# EAGLE design 28DIP (EAGLE 6.4)
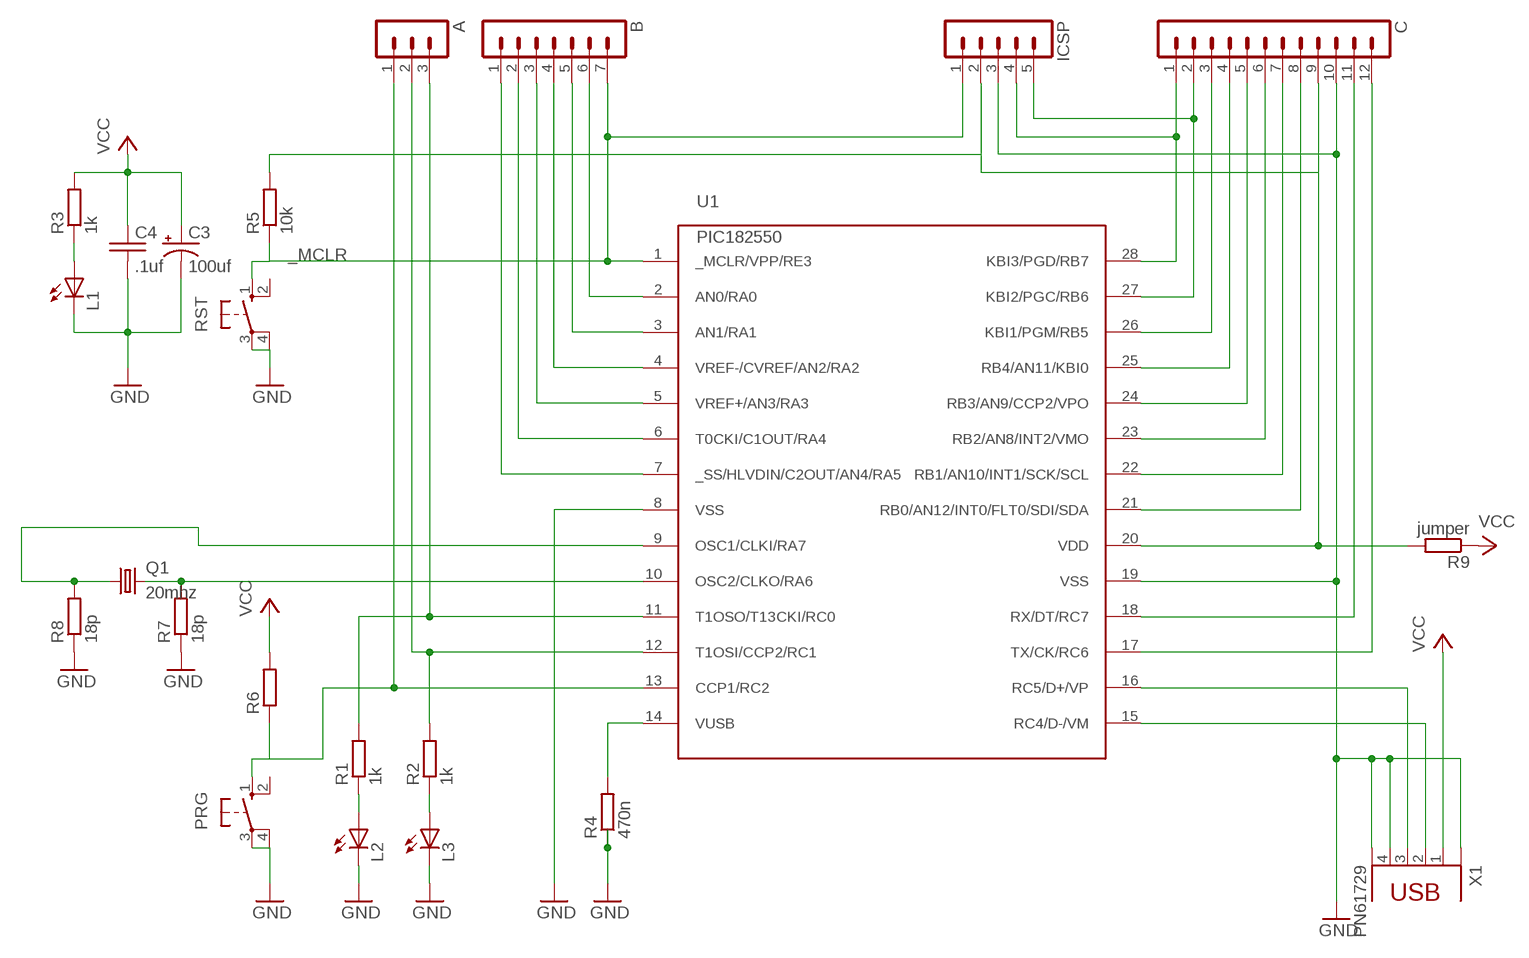
[diagram p0: schematic, sheet 1]

## Parts
A  MA03-1  [MA03-1]
B  MA07-1  [MA07-1]
C  MA12-1  [MA12-1]
C3  100uf  CAP_ELECTROLYTICCAP_0200ELECTROLYTIC_0250  [CAP_0200ELECTROLYTIC_0250]
C4  .1uf  CAPCAP_0100  [CAP_0100]
ICSP  MA05-1  [MA05-1]
L1  LED  [LED5MM]
L2  LED  [LED5MM]
L3  LED  [LED5MM]
PRG  10-XX  [B3F-10XX]
Q1  20mhz  CRYTALHC49S  [HC49/S]
R1  1k  R-EU_M0805  [M0805]
R2  1k  R-EU_M0805  [M0805]
R3  1k  R-EU_M0805  [M0805]
R4  470n  R-EU_M0805  [M0805]
R5  10k  R-EU_M0805  [M0805]
R6  R-EU_M0805  [M0805]
R7  18p  R-EU_M0805  [M0805]
R8  18p  R-EU_M0805  [M0805]
R9  jumper  R-EU_M1206  [M1206]
RST  10-XX  [B3F-10XX]
U1  PIC182550  PIC182455  [DIL28-3]
X1  PN61729  [PN61729]

## Nets
_MCLR: B.7 ICSP.1 R5.1 RST.1(S) U1.1(_MCLR/VPP/RE3)
GND: C3.- C4.2 C.10 ICSP.3 L1.K(C) L2.K(C) L3.K(C) PRG.3(P) PRG.4(P1) R4.1 R7.1 R8.1 RST.3(P) RST.4(P1) U1.8(VSS) U1.19(VSS) X1.4 X1.GND1(G1) X1.GND2(G2)
N$1: U1.16(RC5/D+/VP) X1.3
N$2: C.9 ICSP.2 R5.2 R9.2 U1.20(VDD)
N$4: U1.15(RC4/D-/VM) X1.2
N$5: R4.2 U1.14(VUSB)
N$6: L2.A R1.1
N$7: A.1 PRG.1(S) R6.1 U1.13(CCP1/RC2)
N$8: L3.A R2.1
N$9: L1.A R3.1
N$10: A.3 R1.2 U1.11(T1OSO/T13CKI/RC0)
N$11: A.2 R2.2 U1.12(T1OSI/CCP2/RC1)
N$12: C.1 ICSP.4 U1.28(KBI3/PGD/RB7)
N$13: C.2 ICSP.5 U1.27(KBI2/PGC/RB6)
N$14: C.3 U1.26(KBI1/PGM/RB5)
N$15: C.4 U1.25(RB4/AN11/KBI0)
N$16: C.5 U1.24(RB3/AN9/CCP2/VPO)
N$17: C.6 U1.23(RB2/AN8/INT2/VMO)
N$18: C.7 U1.22(RB1/AN10/INT1/SCK/SCL)
N$19: C.8 U1.21(RB0/AN12/INT0/FLT0/SDI/SDA)
N$20: B.6 U1.2(AN0/RA0)
N$21: B.5 U1.3(AN1/RA1)
N$22: B.4 U1.4(VREF-/CVREF/AN2/RA2)
N$23: B.3 U1.5(VREF+/AN3/RA3)
N$24: B.2 U1.6(T0CKI/C1OUT/RA4)
N$25: B.1 U1.7(_SS/HLVDIN/C2OUT/AN4/RA5)
N$26: C.12 U1.17(TX/CK/RC6)
N$27: C.11 U1.18(RX/DT/RC7)
N$28: Q1.2 R7.2 U1.10(OSC2/CLKO/RA6)
N$31: Q1.1 R8.2 U1.9(OSC1/CLKI/RA7)
VCC: C3.+ C4.1 R3.2 R6.2 R9.1 X1.1
Unconnected: PRG.2(S1) RST.2(S1)

## Library data of the parts
A = UBW:MA03-1: PIN HEADER
B = UBW:MA07-1: PIN HEADER
C = UBW:MA12-1: PIN HEADER
C3 = UBW:CAP_ELECTROLYTIC
C4 = UBW:CAP
ICSP = UBW:MA05-1: PIN HEADER
L1-L3 = UBW:LED
PRG RST = switch-omron:10-XX: OMRON SWITCH; MPN: B3F-1000; OC_FARNELL: 176432; OC_NEWARK: 36M3542
Q1 = crystal:CRYTAL: CRYSTAL
R1-R9 = resistor:R-EU_: RESISTOR, European symbol
U1 = UBW:PIC18*2455
X1 = UBW:PN61729: BERG USB connector

## Board
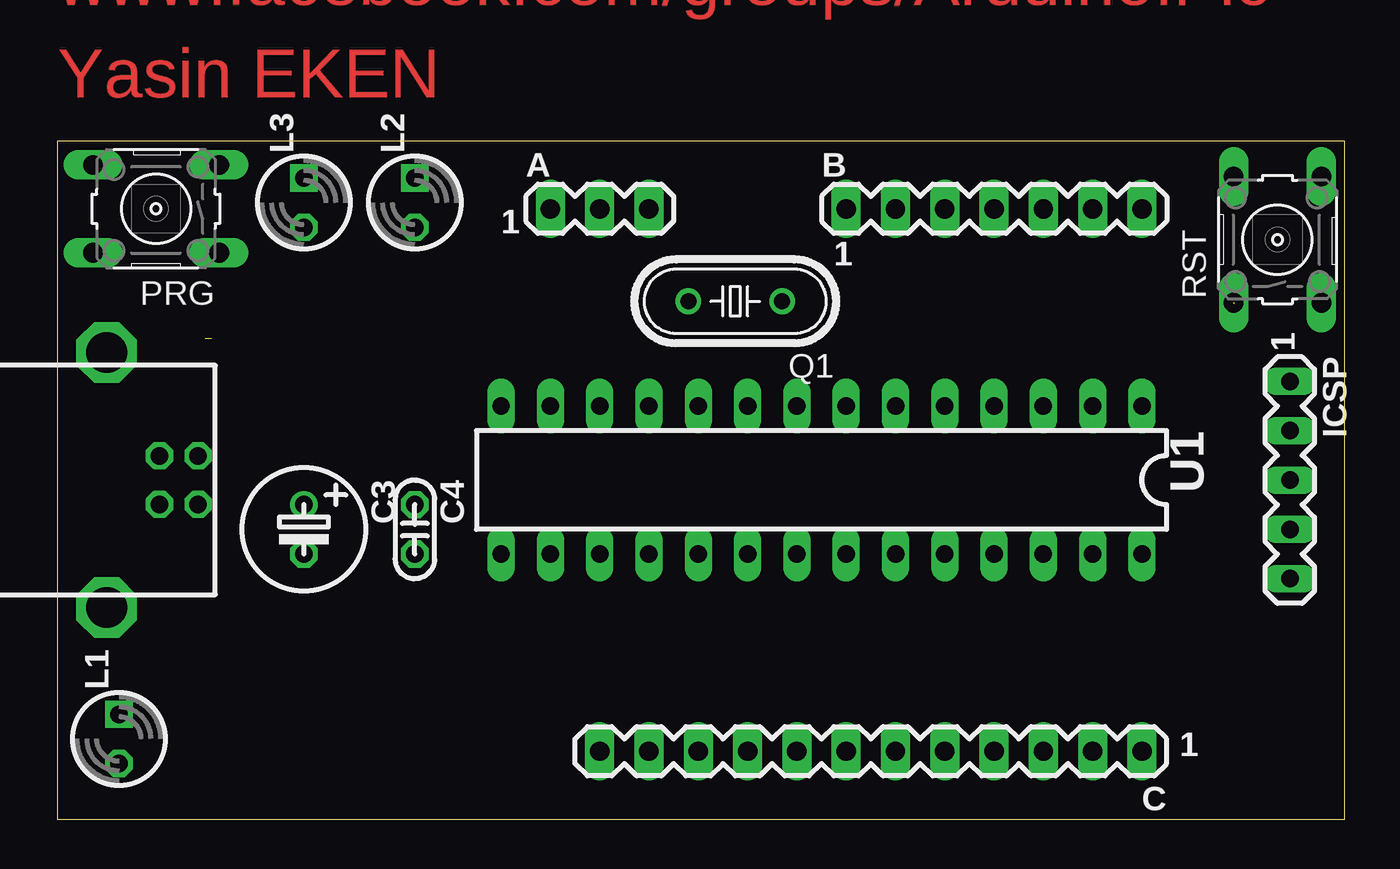
[diagram p1: board, top side]
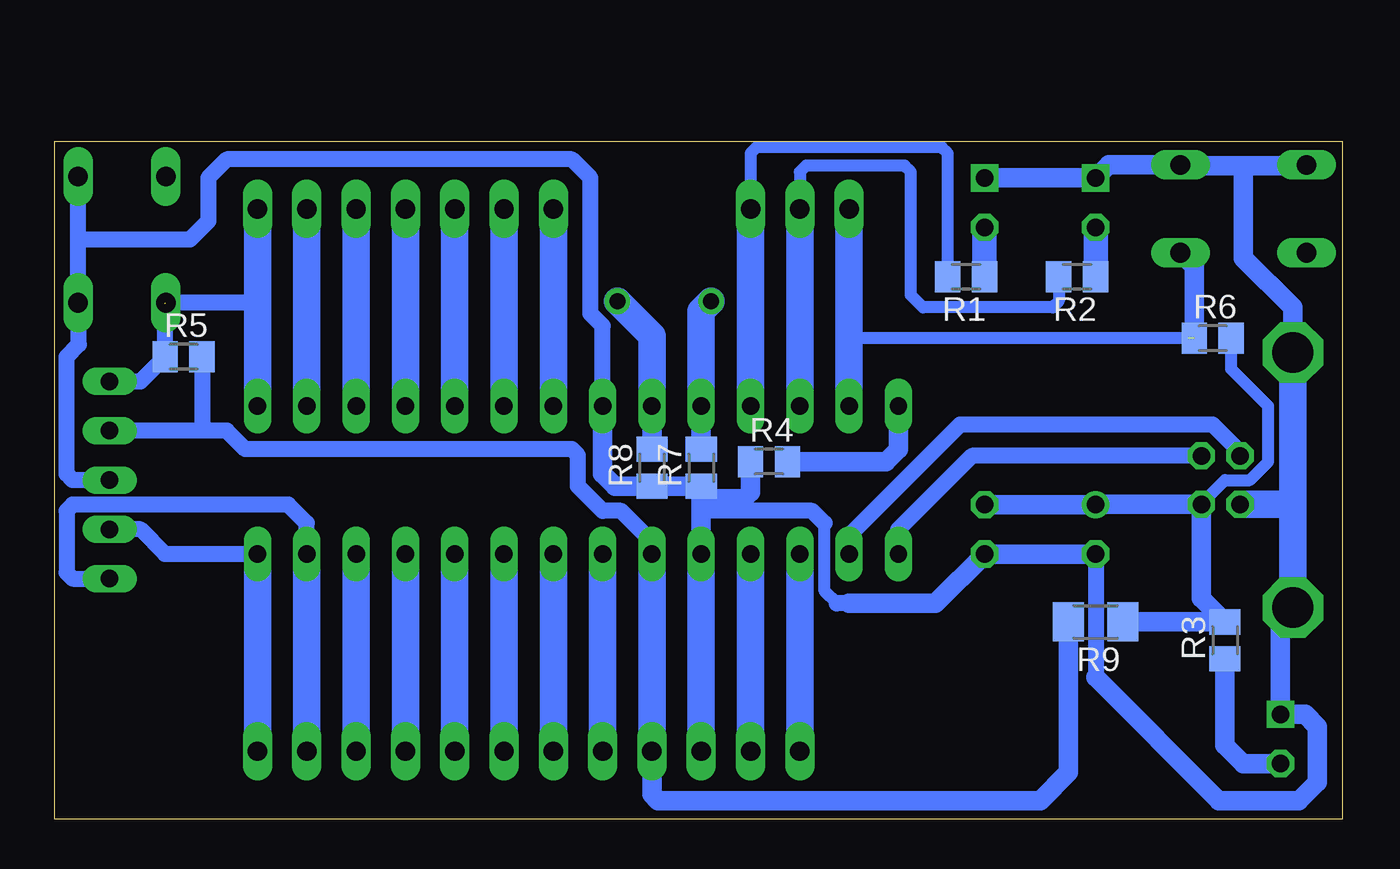
[diagram p2: board, bottom side, seen from below]

Size 66.34 x 34.91 mm. Coordinates in mm from the lower left corner, seen from the top.
Outline: 0,0 66.34,0 66.34,34.91 0,34.91 0,0
Copper layers (1*16): Top 0.035mm / dielectric 1.5mm / Bottom 0.035mm
Design rules "default": minimum track width 10mil, minimum drill 24mil, track to track 8mil, track to pad 8mil, pad to pad 8mil, via to via 8mil, smd to smd 8mil, copper to edge 40mil, drill to drill 8mil, minimum pad ring 10mil, minimum via ring 8mil, stop-mask expansion 4mil, vias tented up to drill 0mil, thermal gap 10mil

### Footprints (pad centres in the part's own frame; a part is rotated, then mirrored left to right if it is on the bottom)
MA03-1 = drill 1 pad 1.27 long: 1 -2.54,0; 2 0,0; 3 2.54,0
MA07-1 = drill 1 pad 1.27 long: 1 -7.62,0; 2 -5.08,0; 3 -2.54,0; 4 0,0; 5 2.54,0; 6 5.08,0; 7 7.62,0
MA12-1 = drill 1 pad 1.27 long: 1 -13.97,0; 2 -11.43,0; 3 -8.89,0; 4 -6.35,0; 5 -3.81,0; 6 -1.27,0; 7 1.27,0; 8 3.81,0; 9 6.35,0; 10 8.89,0; 11 11.43,0; 12 13.97,0
CAP_0200ELECTROLYTIC_0250 = drill 0.9: + -1.27,0 | drill 0.9 octagon: - 1.27,0
CAP_0100 = drill 0.9 octagon: 1 -1.27,0; 2 1.27,0
MA05-1 = drill 0.9 pad 1.27 long: 1 -5.08,0; 2 -2.54,0; 3 0,0; 4 2.54,0; 5 5.08,0
LED5MM = drill 0.9 octagon: A -1.27,0 | drill 0.9 square: K 1.27,0
B3F-10XX = drill 1.016 long: 1 -3.251,2.261; 2 3.251,2.261; 3 -3.251,-2.261; 4 3.251,-2.261
HC49/S = drill 0.813: 1 -2.413,0; 2 2.413,0
M0805 = smd 1.3 x 1.6: 1 -0.95,0; 2 0.95,0
M1206 = smd 1.6 x 2: 1 -1.4,0; 2 1.4,0
DIL28-3 = drill 0.9 long: 1 -16.51,-3.81; 2 -13.97,-3.81; 3 -11.43,-3.81; 4 -8.89,-3.81; 5 -6.35,-3.81; 6 -3.81,-3.81; 7 -1.27,-3.81; 8 1.27,-3.81; 9 3.81,-3.81; 10 6.35,-3.81; 11 8.89,-3.81; 12 11.43,-3.81; 13 13.97,-3.81; 14 16.51,-3.81; 15 16.51,3.81; 16 13.97,3.81; 17 11.43,3.81; 18 8.89,3.81; 19 6.35,3.81; 20 3.81,3.81; 21 1.27,3.81; 22 -1.27,3.81; 23 -3.81,3.81; 24 -6.35,3.81; 25 -8.89,3.81; 26 -11.43,3.81; 27 -13.97,3.81; 28 -16.51,3.81
PN61729 = drill 0.9 octagon: 1 1.25,4.71; 2 -1.25,4.71; 3 -1.25,2.71; 4 1.25,2.71 | drill 2.1 octagon: GND1 -6.57,0; GND2 6.57,0

### Placement (x,y rotation side)
A  27.94,31.43 0 top
B  48.26,31.43 0 top
C  41.91,3.49 180 top
C3  12.7,14.92 270 top
C4  18.41,14.92 270 top
ICSP  63.5,17.46 270 top
L1  3.17,4.13 90 top
L2  18.41,31.75 90 top
L3  12.7,31.75 90 top
PRG  5.08,31.43 180 top
Q1  34.92,26.67 180 top
R1  19.37,27.94 180 bottom
R2  13.65,27.94 180 bottom
R3  6.03,9.21 90 bottom
R4  29.53,18.41 0 bottom
R5  59.69,23.81 0 bottom
R6  6.67,24.77 0 bottom
R7  33.02,18.1 90 bottom
R8  35.56,18.1 90 bottom
R9  12.7,10.16 180 bottom
RST  62.87,29.84 90 top
U1  39.37,17.46 180 top
X1  2.54,17.46 270 top

### Tracks (layer width: path | path; a pad name or v marks a point on that pad's centre or on a via)
_MCLR  (2 unrouted)
  Bottom 0.813: 55.88,32.39 B.7 | R5.1 60.64,26.56 | ICSP.1 61.91,22.54 R5.1 60.64,26.56 | 55.88,26.59 RST.1
  Bottom 1.422: U1.1 55.88,26.59 B.7
GND
  Bottom 0.61: 26.04,11.11 26.67,11.75 26.67,15.24
  Bottom 0.813: C3.- 12.7,7.3 | 25.4,11.11 26.04,11.11 | 26.67,15.24 27.3,15.87 33.02,15.87 | ICSP.3 65.41,17.46 65.72,17.78 65.72,23.81 65.09,24.45 65.09,26.56 RST.3 65.13,29.84 | 65.13,29.84 RST.4 | 38.1,17.78 38.1,25.4 38.73,26.03 38.73,33.02 39.69,33.97 57.47,33.97 58.42,33.02 58.42,30.8 59.37,29.84 65.13,29.84
  Bottom 1.016: R7.1 R8.1 37.47,17.15 38.1,17.78 U1.8 | R7.1 33.02,15.87 U1.19 | X1.GND2 3.17,10.26 L1.K 1.91,5.4 1.27,4.76 1.27,1.91 2.22,0.95 6.35,0.95 12.7,7.3 | R7.1 33.02,16.83 32.7,16.51 30.8,16.51 30.48,16.83 R4.1 | C3.- C4.2 20.95,11.11 25.4,11.11 | X1.GND1 2.54,26.35 5.08,28.89 5.08,33.66 | 5.08,33.66 1.79,33.66 | 1.27,33.66 1.79,33.66 | 1.79,33.66 PRG.4 | L2.K L3.K 12.03,33.69 PRG.3 8.29,33.66 5.08,33.66
  Bottom 1.422: C.10 U1.19 | X1.GND2 2.54,15.87 | 2.54,15.87 X1.GND1 | X1.4 2.88,16.21 2.54,15.87
N$1
  Bottom 0.813: X1.3 5.25,18.9 6.67,20.32 19.68,20.32 25.4,14.6 U1.16
N$2
  Bottom 0.813: U1.20 35.56,14.29 37.15,15.87 38.1,15.87 39.37,17.14 39.37,18.73 39.69,19.05 56.52,19.05 57.47,20 58.42,20 | 58.42,20 ICSP.2 | R5.2 58.74,20.32 58.42,20
  Bottom 1.016: R9.2 14.1,2.41 15.56,0.95 35.24,0.95 35.56,1.27 C.9
  Bottom 1.422: C.9 U1.20
N$4
  Bottom 0.813: X1.2 19.07,18.71 22.86,14.92 U1.15
N$5
  Bottom 1.016: R4.2 23.5,18.41 22.86,19.05 U1.14
N$6
  Bottom 1.27: L2.A R1.1
N$7  (1 unrouted)
  Bottom 0.61: 7.62,25.08 7.94,24.76 25.4,24.76
  Bottom 1.016: 7.62,25.08 7.62,28.46 PRG.1
  Bottom 1.422: U1.13 25.4,24.76 A.1
N$8
  Bottom 1.27: R2.1 L3.A
N$9
  Bottom 1.016: R3.1 6.03,3.81 5.08,2.86 L1.A
N$10
  Bottom 0.61: R1.2 20.32,34.29 20.64,34.61 30.16,34.61 30.48,34.29 A.3
  Bottom 1.422: U1.11 A.3
N$11
  Bottom 0.61: R2.2 14.6,26.67 14.92,26.35 21.59,26.35 22.23,26.99 22.23,33.34 22.54,33.66 27.62,33.66 27.94,33.34 A.2
  Bottom 1.422: U1.12 A.2
N$12
  Bottom 0.813: U1.28 60.64,13.65 61.91,14.92 ICSP.4
  Bottom 1.422: C.1 U1.28
N$13
  Bottom 0.813: U1.27 53.34,15.24 54.29,16.19 65.41,16.19 65.72,15.87 65.72,12.7 65.41,12.38 ICSP.5
  Bottom 1.422: C.2 U1.27
N$14
  Bottom 1.422: C.3 U1.26
N$15
  Bottom 1.422: C.4 U1.25
N$16
  Bottom 1.422: C.5 U1.24
N$17
  Bottom 1.422: C.6 U1.23
N$18
  Bottom 1.422: C.7 U1.22
N$19
  Bottom 1.422: C.8 U1.21
N$20
  Bottom 1.422: U1.2 B.6
N$21
  Bottom 1.422: U1.3 B.5
N$22
  Bottom 1.422: U1.4 B.4
N$23
  Bottom 1.422: U1.5 B.3
N$24
  Bottom 1.422: U1.6 B.2
N$25
  Bottom 1.422: U1.7 B.1
N$26
  Bottom 1.422: C.12 U1.17
N$27
  Bottom 1.422: C.11 U1.18
N$28
  Bottom 1.016: R7.2 U1.10
  Bottom 1.422: U1.10 33.02,26.16 Q1.2
N$31
  Bottom 1.016: R8.2 U1.9
  Bottom 1.422: U1.9 35.56,24.89 Q1.1
VCC
  Bottom 0.61: X1.1 7.25,16.25 6.03,17.46 4.76,17.46 3.81,18.41 3.81,21.27 5.71,23.18 R6.2
  Bottom 1.016: C4.1 C3.+ 12.68,16.21 X1.1 7.25,11.37 R3.2 R9.1

### Text on the board
Top: www.facebook.com/groups/Arduino.Pic | Yasin EKEN